# Altium schematic sheet tt.schdoc
size 58 x 58 mm
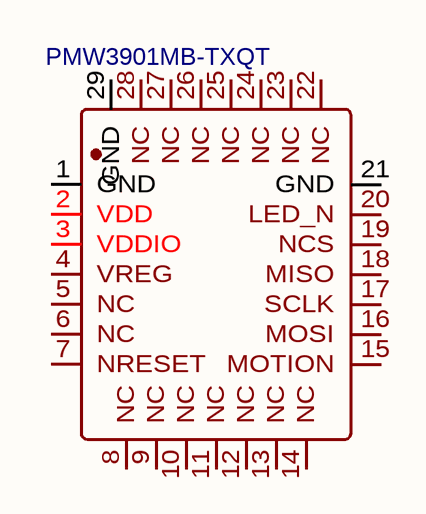
[diagram p0: tt.schdoc]

## Parts
GND  PMW3901MB-TXQT  [COB-28_L6.0-W6.0-P0.65-TL-EP]

## Nets

Not connected (* = marked no-connect by the designer): GND 1(GND) 2(VDD) 3(VDDIO) 4(VREG) 5(NC) 6(NC) 7(NRESET) 8(NC) 9(NC) 10(NC) 11(NC) 12(NC) 13(NC) 14(NC) 15(MOTION) 16(MOSI) 17(SCLK) 18(MISO) 19(NCS) 20(LED_N) 21(GND) 22(NC) 23(NC) 24(NC) 25(NC) 26(NC) 27(NC) 28(NC) 29(GND)

## Library data of the parts
GND = PMW3901MB-TXQT: BOM_Manufacturer: 原相科技; Contributor: lcsc; BOM_Supplier: LCSC; BOM_Supplier Part: C9900000235; BOM_Manufacturer Part: PMW3901MB-TXQT; link: https://img.jlc.com/pdf/applyPasteComponent/2021-09-16/127157A/823778c2e8ae49a5bc03068b1c45fedd/PMW3901MB.pdf; spicePre: U; spiceSymbolName: PMW3901MB-TXQT